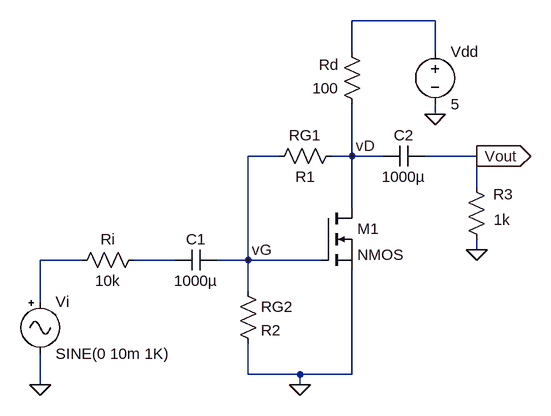
[diagram p0: schematic circuito2.asc]
circuito2.asc, the LTspice schematic file:
Version 4
SHEET 1 880 680
WIRE 624 -336 496 -336
WIRE 496 -288 496 -336
WIRE 624 -288 624 -336
WIRE 624 -192 624 -208
WIRE 384 -128 336 -128
WIRE 496 -128 496 -208
WIRE 496 -128 464 -128
WIRE 544 -128 496 -128
WIRE 688 -128 608 -128
WIRE 688 -80 688 -128
WIRE 496 -48 496 -128
WIRE 688 16 688 0
WIRE 80 32 16 32
WIRE 224 32 160 32
WIRE 336 32 336 -128
WIRE 336 32 288 32
WIRE 448 32 336 32
WIRE 336 80 336 32
WIRE 16 96 16 32
WIRE 336 208 336 160
WIRE 416 208 336 208
WIRE 496 208 496 48
WIRE 496 208 416 208
WIRE 16 224 16 176
WIRE 416 224 416 208
FLAG 16 224 0
FLAG 624 -192 0
FLAG 416 224 0
FLAG 688 16 0
FLAG 336 32 vG
FLAG 496 -128 vD
FLAG 688 -128 Vout
IOPIN 688 -128 Out
SYMBOL Misc\\signal 16 80 R0
SYMATTR InstName Vi
SYMATTR Value SINE(0 10m 1K)
SYMBOL res 176 16 R90
WINDOW 0 0 56 VBottom 2
WINDOW 3 32 56 VTop 2
SYMATTR InstName Ri
SYMATTR Value 10k
SYMBOL cap 288 16 R90
WINDOW 0 0 32 VBottom 2
WINDOW 3 32 32 VTop 2
SYMATTR InstName C1
SYMATTR Value 1000µ
SYMBOL res 320 64 R0
SYMATTR InstName RG2
SYMATTR Value R2
SYMBOL res 480 -144 R90
WINDOW 0 0 56 VBottom 2
WINDOW 3 32 56 VTop 2
SYMATTR InstName RG1
SYMATTR Value R1
SYMBOL res 512 -192 R180
WINDOW 0 36 76 Left 2
WINDOW 3 36 40 Left 2
SYMATTR InstName Rd
SYMATTR Value 100
SYMBOL res 704 16 R180
WINDOW 0 -40 85 Left 2
WINDOW 3 -36 46 Left 2
SYMATTR InstName R3
SYMATTR Value 1k
SYMBOL cap 608 -144 R90
WINDOW 0 0 32 VBottom 2
WINDOW 3 32 32 VTop 2
SYMATTR InstName C2
SYMATTR Value 1000µ
SYMBOL voltage 624 -304 R0
WINDOW 123 0 0 Left 0
WINDOW 39 0 0 Left 0
SYMATTR InstName Vdd
SYMATTR Value 5
SYMBOL nmos 448 -48 R0
SYMATTR InstName M1

The netlist it stands for:
* circuito2.asc
Vi N002 0 SINE(0 10m 1K)
Ri N003 N002 10k
C1 vG N003 1000µ
RG2 vG 0 R2
RG1 vD vG R1
Rd vD N001 100
R3 0 Vout 1k
C2 Vout vD 1000µ
Vdd N001 0 5
M1 vD vG 0 0 NMOS
.model NMOS NMOS
.model PMOS PMOS
.lib standard.mos
.backanno
.end